# EAGLE design ACS770 breakout v0.1 (EAGLE 7.7.0)
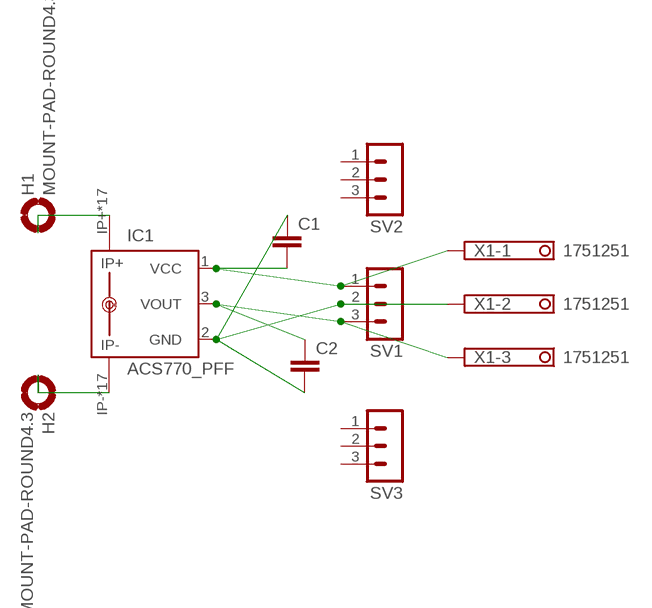
[diagram p0: schematic, sheet 1]

## Parts
C1  C-EU025-025X050  [C025-025X050]
C2  C-EU025-025X050  [C025-025X050]
H1  MOUNT-PAD-ROUND4.3  [4,3-PAD]
H2  MOUNT-PAD-ROUND4.3  [4,3-PAD]
IC1  ACS770_PFF  ACS758LCB-050B-PFF-T  [CB-PFF]
SV1  MA03-1  [MA03-1]
SV2  MA03-1  [MA03-1]
SV3  MA03-1  [MA03-1]
X1  1751251  [1751251]

## Nets
GND: C1.1 C2.2 IC1.2(GND) SV1.2 X1.2
N$1: C1.2 IC1.1(VCC) SV1.1 X1.1
N$3: C2.1 IC1.3(VOUT) SV1.3 X1.3
N$4: H2.B4,3(MOUNT) IC1.IP- IC1.IP-@2(IP-) IC1.IP-@3(IP-) IC1.IP-@4(IP-) IC1.IP-@5(IP-) IC1.IP-@6(IP-) IC1.IP-@7(IP-) IC1.IP-@8(IP-) IC1.IP-@9(IP-) IC1.IP-@10(IP-) IC1.IP-@11(IP-) IC1.IP-@12(IP-) IC1.IP-@13(IP-) IC1.IP-@14(IP-) IC1.IP-@15(IP-) IC1.IP-@16(IP-) IC1.IP-@17(IP-)
N$5: H1.B4,3(MOUNT) IC1.IP+ IC1.IP+@2(IP+) IC1.IP+@3(IP+) IC1.IP+@4(IP+) IC1.IP+@5(IP+) IC1.IP+@6(IP+) IC1.IP+@7(IP+) IC1.IP+@8(IP+) IC1.IP+@9(IP+) IC1.IP+@10(IP+) IC1.IP+@11(IP+) IC1.IP+@12(IP+) IC1.IP+@13(IP+) IC1.IP+@14(IP+) IC1.IP+@15(IP+) IC1.IP+@16(IP+) IC1.IP+@17(IP+)
Unconnected: SV2.1 SV2.2 SV2.3 SV3.1 SV3.2 SV3.3

## Library data of the parts
C1 C2 = rcl7:C-EU: CAPACITOR, European symbol
H1 H2 = holes:MOUNT-PAD-ROUND: MOUNTING PAD, round
IC1 = allegro:ACS758*: Thermally Enhanced, Fully Integrated, Hall Effect-Based Linear Current Sensor with 100 micro Ohm Current Conductor display layer 49 Reference in BRD and place VIAs on circles Source: http://www.allegromicro.com/en/Products/Part_Numbers/0758/0758.pdf; MPN: ACS758LCB-050B-PFF-T; OC_FARNELL: 1718997; OC_NEWARK: 04R7131
SV1-SV3 = con-lstb:MA03-1: PIN HEADER; OC_FARNELL: unknown; OC_NEWARK: unknown
X1 = con-phoenix-350:1751251: MKDS 1/ 3-3,5 Printklemme Nennstrom: 10 A Bemessungsspannung: 160 V Raster: 3,5 mm Polzahl: 3 Montageart: Löten Anschlussart: Schraubanschluss Anschlussrichtung vom Leiter zur Platine: 0° Source: http://eshop.phoenixcontact.com .. 1751251.pdf; OC_FARNELL: unknown; OC_NEWARK: unknown

## Board
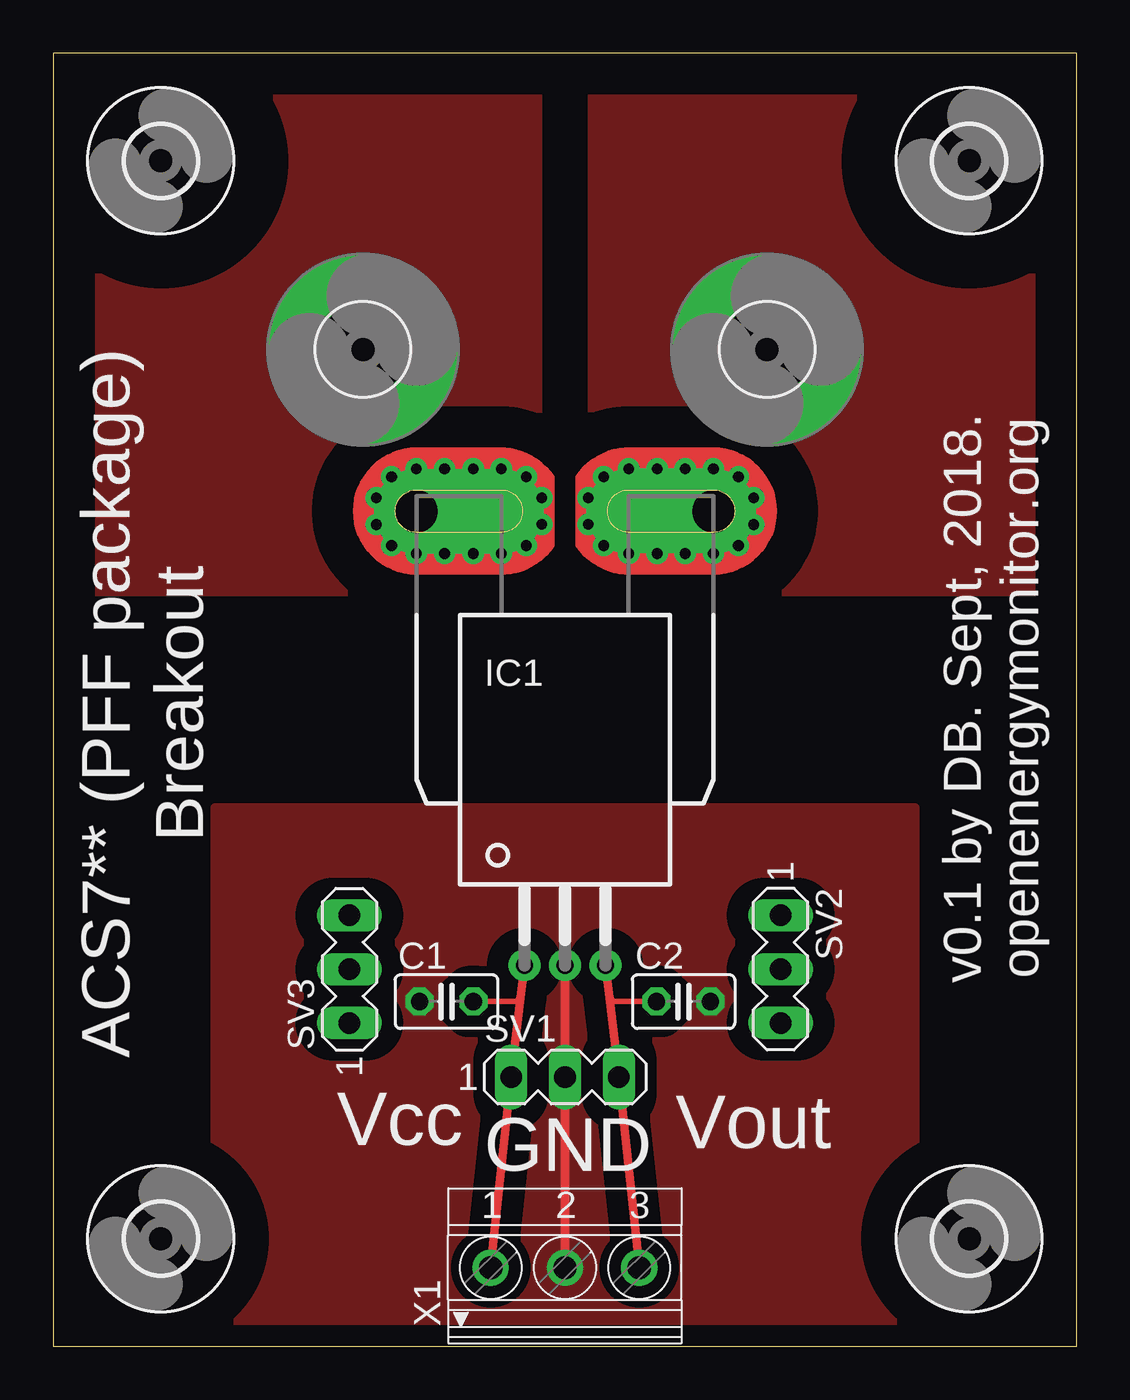
[diagram p1: board, top side]
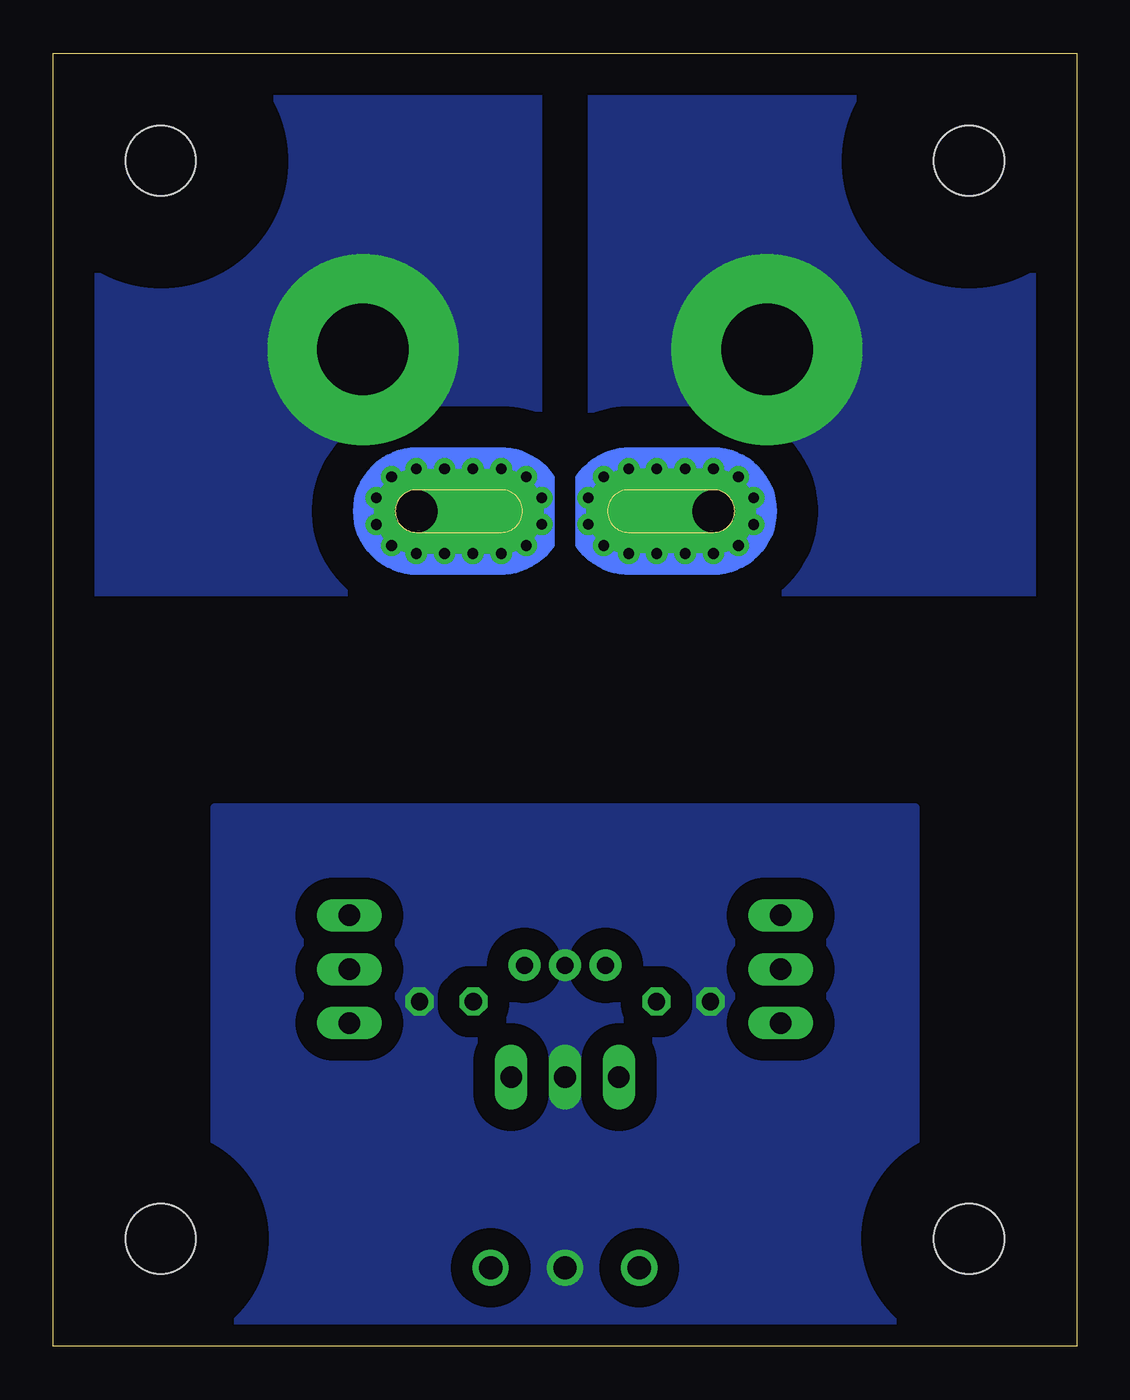
[diagram p2: board, bottom side, seen from below]

Size 48.26 x 60.96 mm. Coordinates in mm from the lower left corner, seen from the top.
Outline: 0,0 48.26,0 48.26,60.96 0,60.96 0,0
Copper layers (1*16): Top 0.035mm / dielectric 1.5mm / Bottom 0.035mm
Design rules "default": minimum track width 10mil, minimum drill 19mil, track to track 8mil, track to pad 8mil, pad to pad 8mil, via to via 8mil, smd to smd 8mil, copper to edge 40mil, drill to drill 8mil, minimum pad ring 10mil, minimum via ring 8mil, stop-mask expansion 4mil, vias tented up to drill 0mil, thermal gap 10mil

### Footprints (pad centres in the part's own frame; a part is rotated, then mirrored left to right if it is on the bottom)
C025-025X050 = drill 0.813 octagon: 1 -1.27,0; 2 1.27,0
4,3-PAD = drill 4.3 pad 9: B4,3 0,0
CB-PFF = drill 0.8 pad 1.5: 1 -1.91,-21.4; 2 0,-21.4; 3 1.91,-21.4 | drill 2 pad 4 offset: IP+ 7,0; IP- -7,0 | drill 0.5 pad 0.9: IP+@2 8.89,0.635; IP+@3 8.89,-0.635; IP+@4 8.175,-1.625; IP+@5 7,-2; IP+@6 5.675,-2; IP+@7 4.35,-2; IP+@8 3,-2; IP+@9 1.825,-1.625; IP+@10 1.1,-0.625; IP+@11 1.1,0.625; IP+@12 1.825,1.625; IP+@13 3,2; IP+@14 4.35,2; IP+@15 5.675,2; IP+@16 7,2; IP+@17 8.175,1.625; IP-@2 -8.89,0.635; IP-@3 -8.89,-0.635; IP-@4 -8.175,-1.625; IP-@5 -7,-2; IP-@6 -5.675,-2; IP-@7 -4.325,-2; IP-@8 -3,-2; IP-@9 -1.825,-1.625; IP-@10 -1.1,-0.625; IP-@11 -1.1,0.625; IP-@12 -1.825,1.625; IP-@13 -3,2; IP-@14 -4.325,2; IP-@15 -5.675,2; IP-@16 -7,2; IP-@17 -8.175,1.625
MA03-1 = drill 1.016 long: 1 -2.54,0; 2 0,0; 3 2.54,0
3,3 = hole 3.3: 0,0
1751251 = drill 1.1 pad 1.7: 1 -3.5,-0.1; 2 0,-0.1; 3 3.5,-0.1

### Placement (x,y rotation side)
C1  18.54,16.26 0 top
C2  29.72,16.26 0 top
H1  33.66,46.99 0 top
H2  14.61,46.99 0 top
IC1  24.13,39.37 0 top
SV1  24.13,12.7 0 top
SV2  34.29,17.78 270 top
SV3  13.97,17.78 90 top
U$1  [3,3]  5.08,55.88 0 top
U$2  [3,3]  43.18,55.88 0 top
U$3  [3,3]  43.18,5.08 0 top
U$4  [3,3]  5.08,5.08 0 top
X1  24.13,3.81 0 top

### Tracks (layer width: path | path; a pad name or v marks a point on that pad's centre or on a via)
GND
  Top 0.406: IC1.2 SV1.2 X1.2
  pour Top (isolate 1.016, no thermals): 7.62,25.4 40.64,25.4 40.64,0 7.62,0
  pour Bottom (isolate 1.016, no thermals): 40.64,25.4 7.62,25.4 7.62,0 40.64,0
N$1
  Top 0.254: C1.2 21.84,16.26 22.04,16.46
  Top 0.406: IC1.1 22.04,16.46 SV1.1 X1.1
N$3
  Top 0.254: C2.1 26.42,16.26 26.22,16.46
  Top 0.406: IC1.3 26.22,16.46 SV1.3 X1.3
N$4
  pour Top (isolate 1.93, no thermals): 22.86,35.56 1.27,35.56 1.27,59.69 22.86,59.69
  pour Bottom (isolate 1.93, no thermals): 22.86,35.56 1.27,35.56 1.27,59.69 22.86,59.69
N$5
  pour Top (isolate 1.93, no thermals): 46.99,35.56 25.4,35.56 25.4,59.69 46.99,59.69
  pour Bottom (isolate 1.93, no thermals): 46.99,35.56 25.4,35.56 25.4,59.69 46.99,59.69

### Text on the board
tNames: v0.1 by DB. Sept, 2018. / openenergymonitor.org | ACS7** (PFF package) / Breakout | Vcc | Vout | GND